# EAGLE design cc-driver-pico-host-board-as-built (EAGLE 7.7.0)
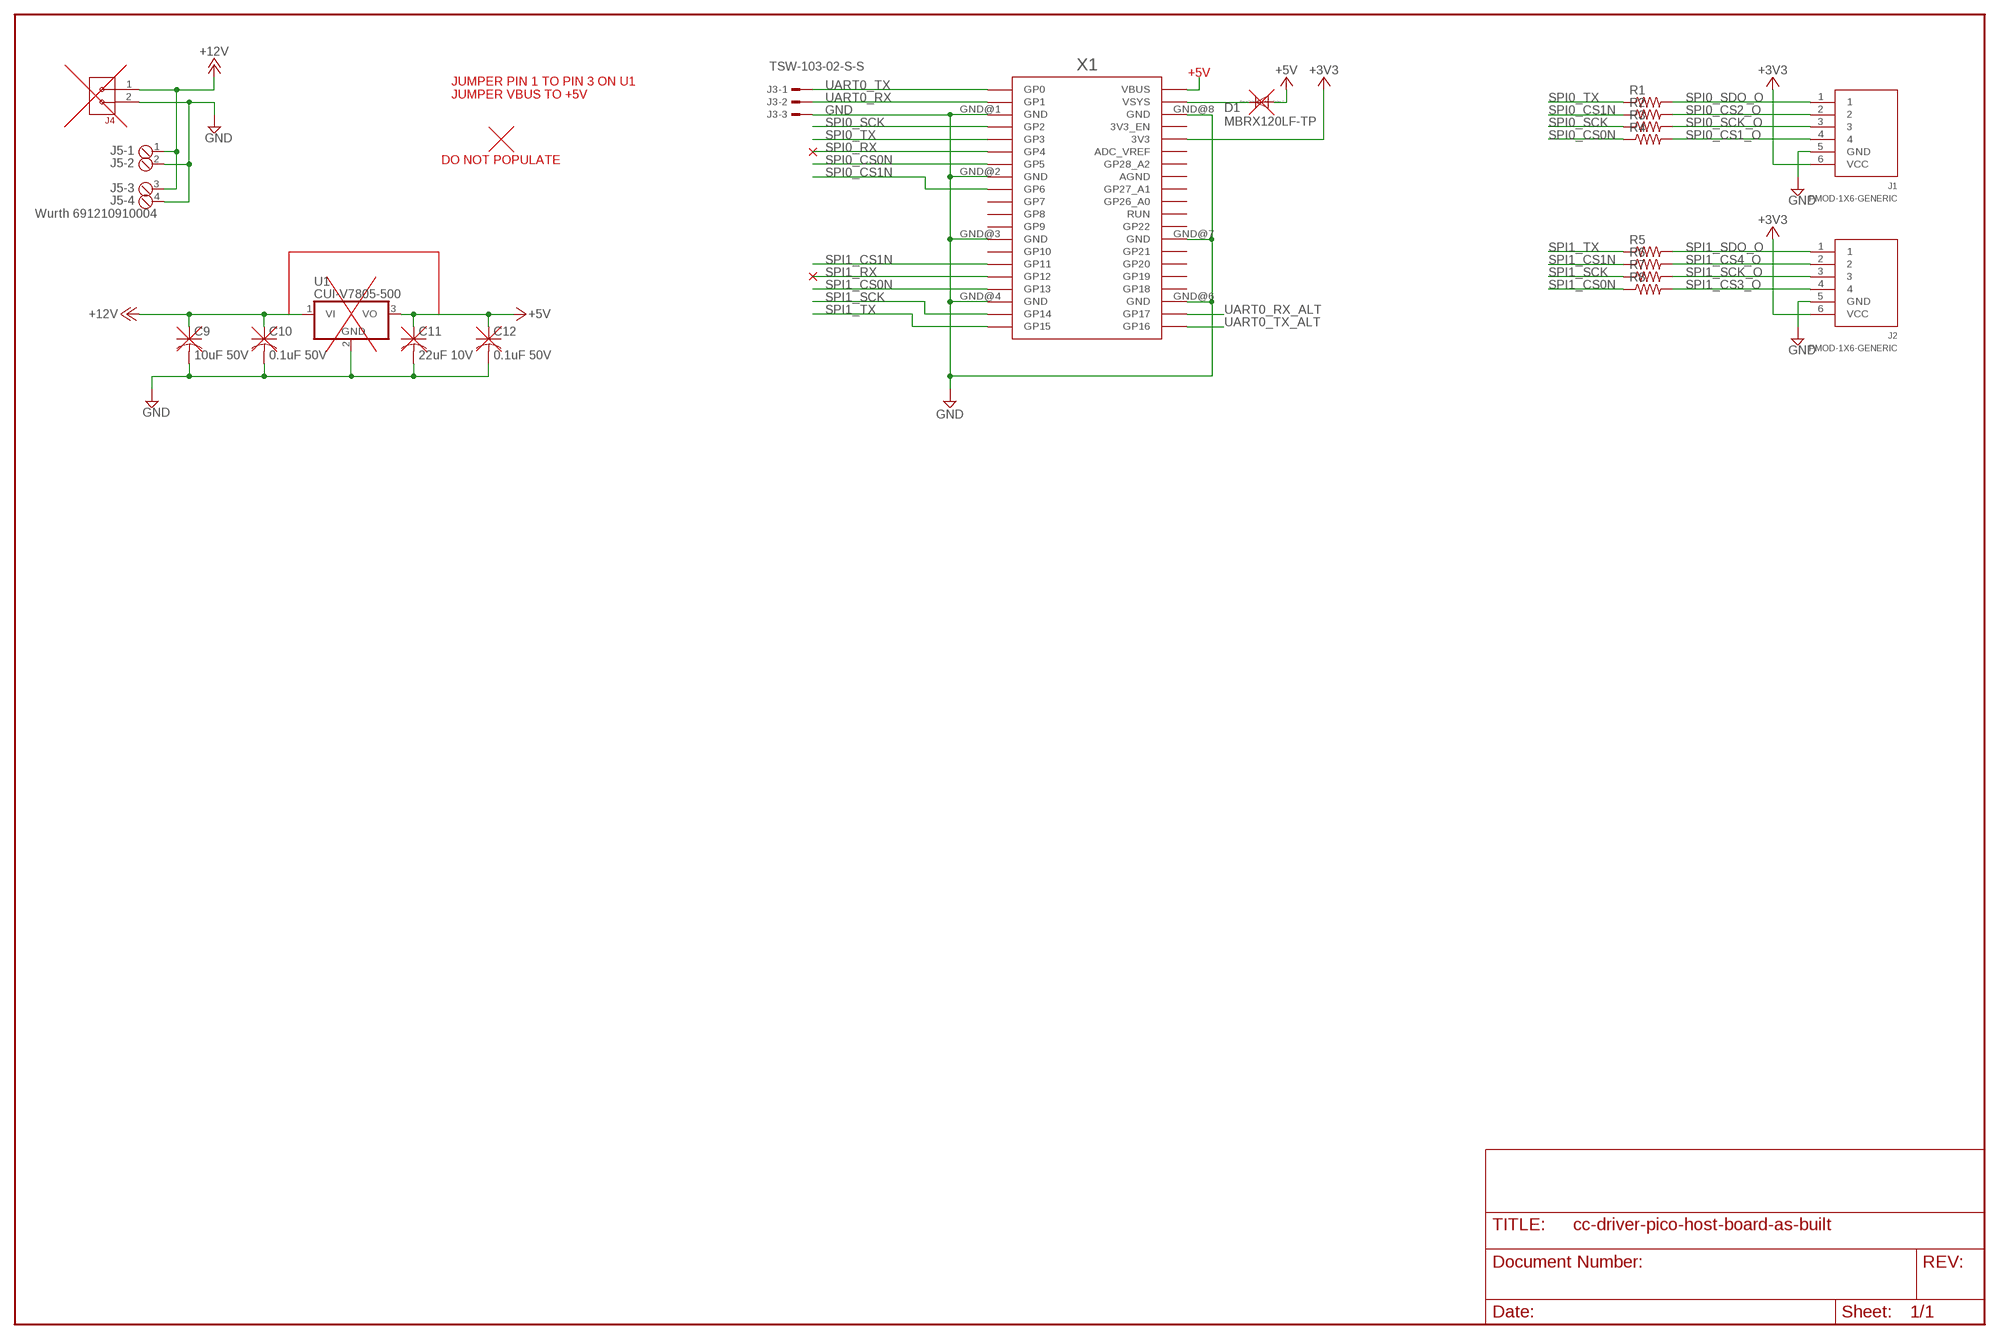
[diagram p0: schematic, sheet 1]

## Parts
C9  10uF 50V  C-USC1210K  [C1210K]
C10  0.1uF 50V  C-USC1206K  [C1206K]
C11  22uF 10V  C-USC1206K  [C1206K]
C12  0.1uF 50V  C-USC1206K  [C1206K]
D1  MBRX120LF-TP  MBR0520LT  [SOD123]
J1  PMOD-1X6-GENERIC  [CON-PMOD-1X6]
J2  PMOD-1X6-GENERIC  [CON-PMOD-1X6]
J3  TSW-103-02-S-S  [TSW-103-02-S-S]
J4  CON-3.81MM-1X2-PHOENIX  [CON-PHOENIX-3.81-1X2-RA]
J5  Wurth 691210910004  MPT4  [4POL254]
R1  R-US_R0603  [R0603]
R2  R-US_R0603  [R0603]
R3  R-US_R0603  [R0603]
R4  R-US_R0603  [R0603]
R5  R-US_R0603  [R0603]
R6  R-US_R0603  [R0603]
R7  R-US_R0603  [R0603]
R8  R-US_R0603  [R0603]
U1  CUI-V7805-500  CUI-V7803-500  [CUI-78XX-500]
X1  RPI_PICO_IG-TH  [RPI_PICO_TH]

## Nets
+3V3: J1.6(VCC) J2.6(VCC) X1.3V3
+5V: C11.1 C12.1 D1.A U1.3(VO)
+12V: C9.1 C10.1 J4.1 J5.1 J5.3 U1.1(VI)
GND: C9.2 C10.2 C11.2 C12.2 J1.5(GND) J2.5(GND) J3.3 J4.2 J5.2 J5.4 U1.2(GND) X1.GND@1(GND) X1.GND@2(GND) X1.GND@3(GND) X1.GND@4(GND) X1.GND@6(GND) X1.GND@7(GND) X1.GND@8(GND)
N$1: X1.VBUS
SPI0_CS0N: R4.1 X1.GP5
SPI0_CS1_O: J1.4 R4.2
SPI0_CS1N: R2.1 X1.GP6
SPI0_CS2_O: J1.2 R2.2
SPI0_RX: X1.GP4
SPI0_SCK: R3.1 X1.GP2
SPI0_SCK_O: J1.3 R3.2
SPI0_SDO_O: J1.1 R1.2
SPI0_TX: R1.1 X1.GP3
SPI1_CS0N: R8.1 X1.GP13
SPI1_CS1N: R6.1 X1.GP11
SPI1_CS3_O: J2.4 R8.2
SPI1_CS4_O: J2.2 R6.2
SPI1_RX: X1.GP12
SPI1_SCK: R7.1 X1.GP14
SPI1_SCK_O: J2.3 R7.2
SPI1_SDO_O: J2.1 R5.2
SPI1_TX: R5.1 X1.GP15
UART0_RX: J3.2 X1.GP1
UART0_RX_ALT: X1.GP17
UART0_TX: J3.1 X1.GP0
UART0_TX_ALT: X1.GP16
VSYS: D1.C X1.VSYS
Unconnected: X1.3V3_EN X1.ADC_VREF X1.AGND X1.GP7 X1.GP8 X1.GP9 X1.GP10 X1.GP18 X1.GP19 X1.GP20 X1.GP21 X1.GP22 X1.GP26_A0 X1.GP27_A1 X1.GP28_A2 X1.RUN

## Notes on the sheet
- JUMPER PIN 1 TO PIN 3 ON U1
  JUMPER VBUS TO +5V
- +5V
- DO NOT POPULATE

## Library data of the parts
C9 = rcl:C-US: CAPACITOR, American symbol; MFR: KEMET; MFR_PART_NO: C1210C106K5RACTU
C10 C12 = rcl:C-US: CAPACITOR, American symbol; MFR: KEMET; MFR_PART_NO: C1206S104M5RACTU
C11 = rcl:C-US: CAPACITOR, American symbol; MFR: KEMET; MFR_PART_NO: C1206C226K8RAC7800
D1 = diode:MBR0520LT: SCHOTTKY BARRIER RECTIFIER Source: http://onsemi.com .. MBR0520LT1-D.pdf
J1 J2 = 0GlenConnectors:PMOD-1X6-GENERIC
J3 = con-samtec:TSW-103-02-S-S: THROUGH-HOLE .025" SQ POST HEADER Source: Samtec TSW.pdf; OC_FARNELL: unknown; OC_NEWARK: unknown
J4 = 0GlenConnectors:CON-3.81MM-1X2-PHOENIX
J5 = con-phoenix-254:MPT4: PHOENIX CONNECTOR; OC_FARNELL: unknown; OC_NEWARK: unknown
R1-R8 = rcl:R-US_: RESISTOR, American symbol
U1 = GlenPartsLibrary:CUI-V7803-500
X1 = RaspberryPi_Pico:RPI_PICO_IG

## Board
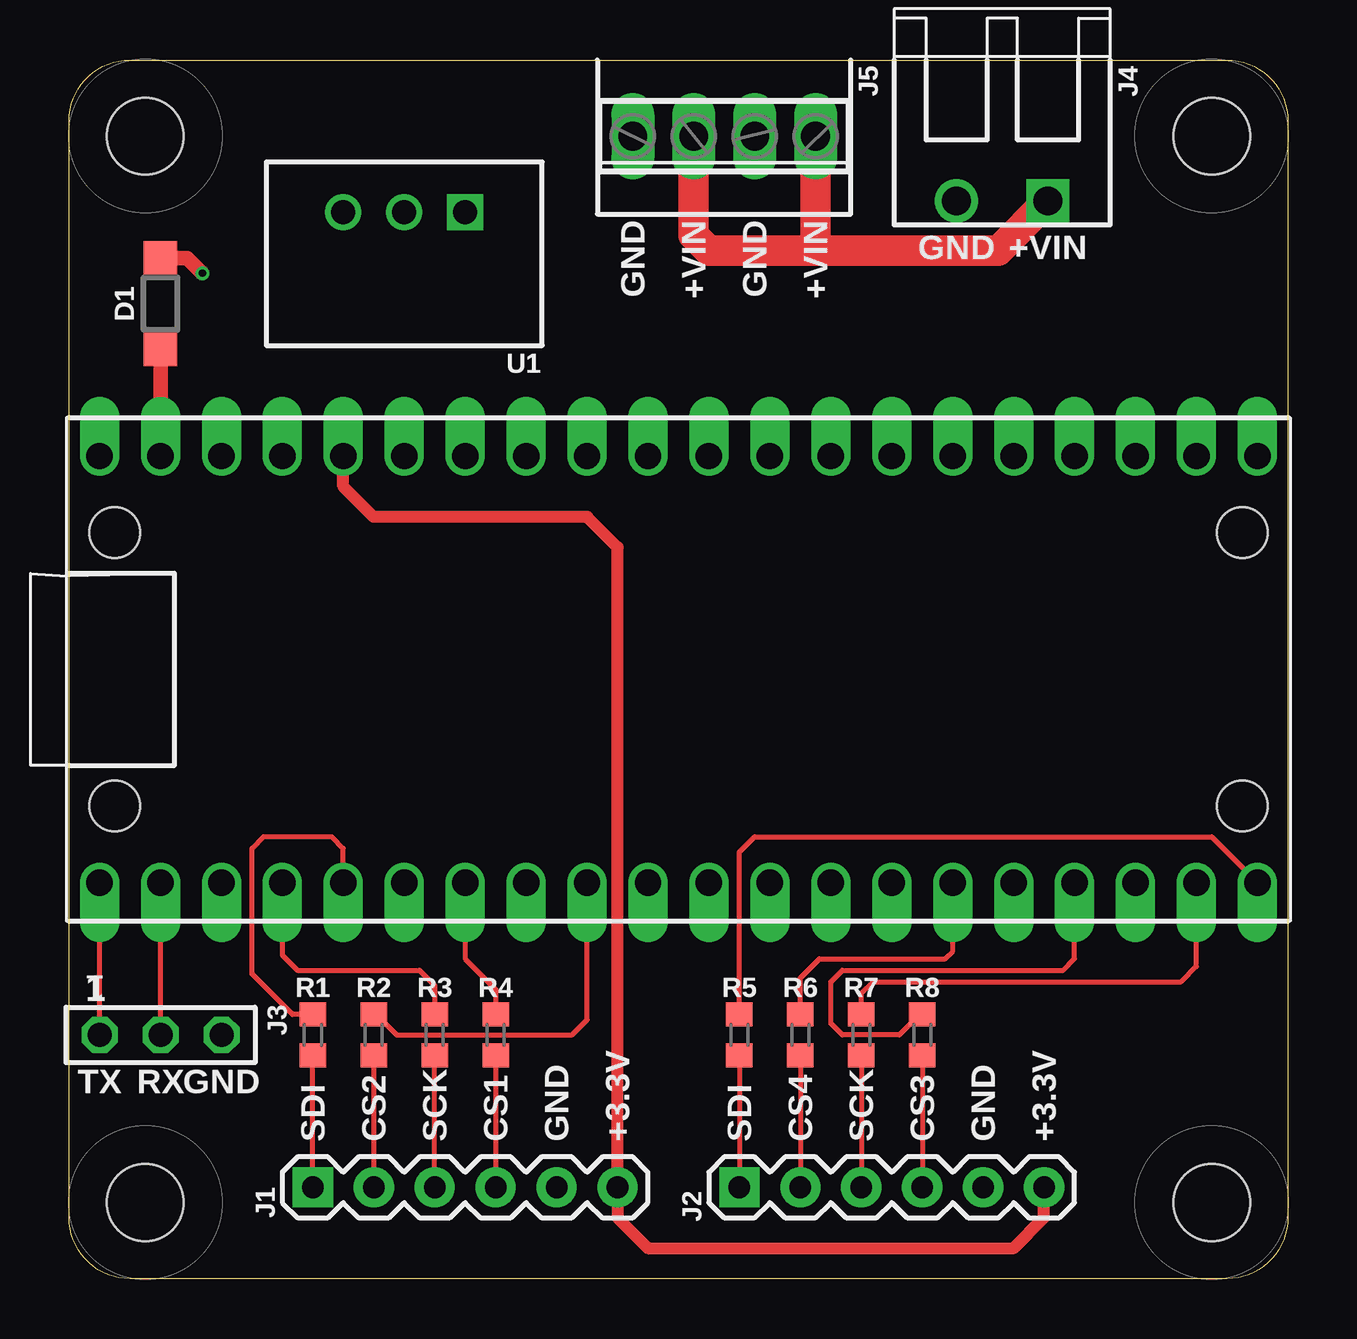
[diagram p1: board, top side]
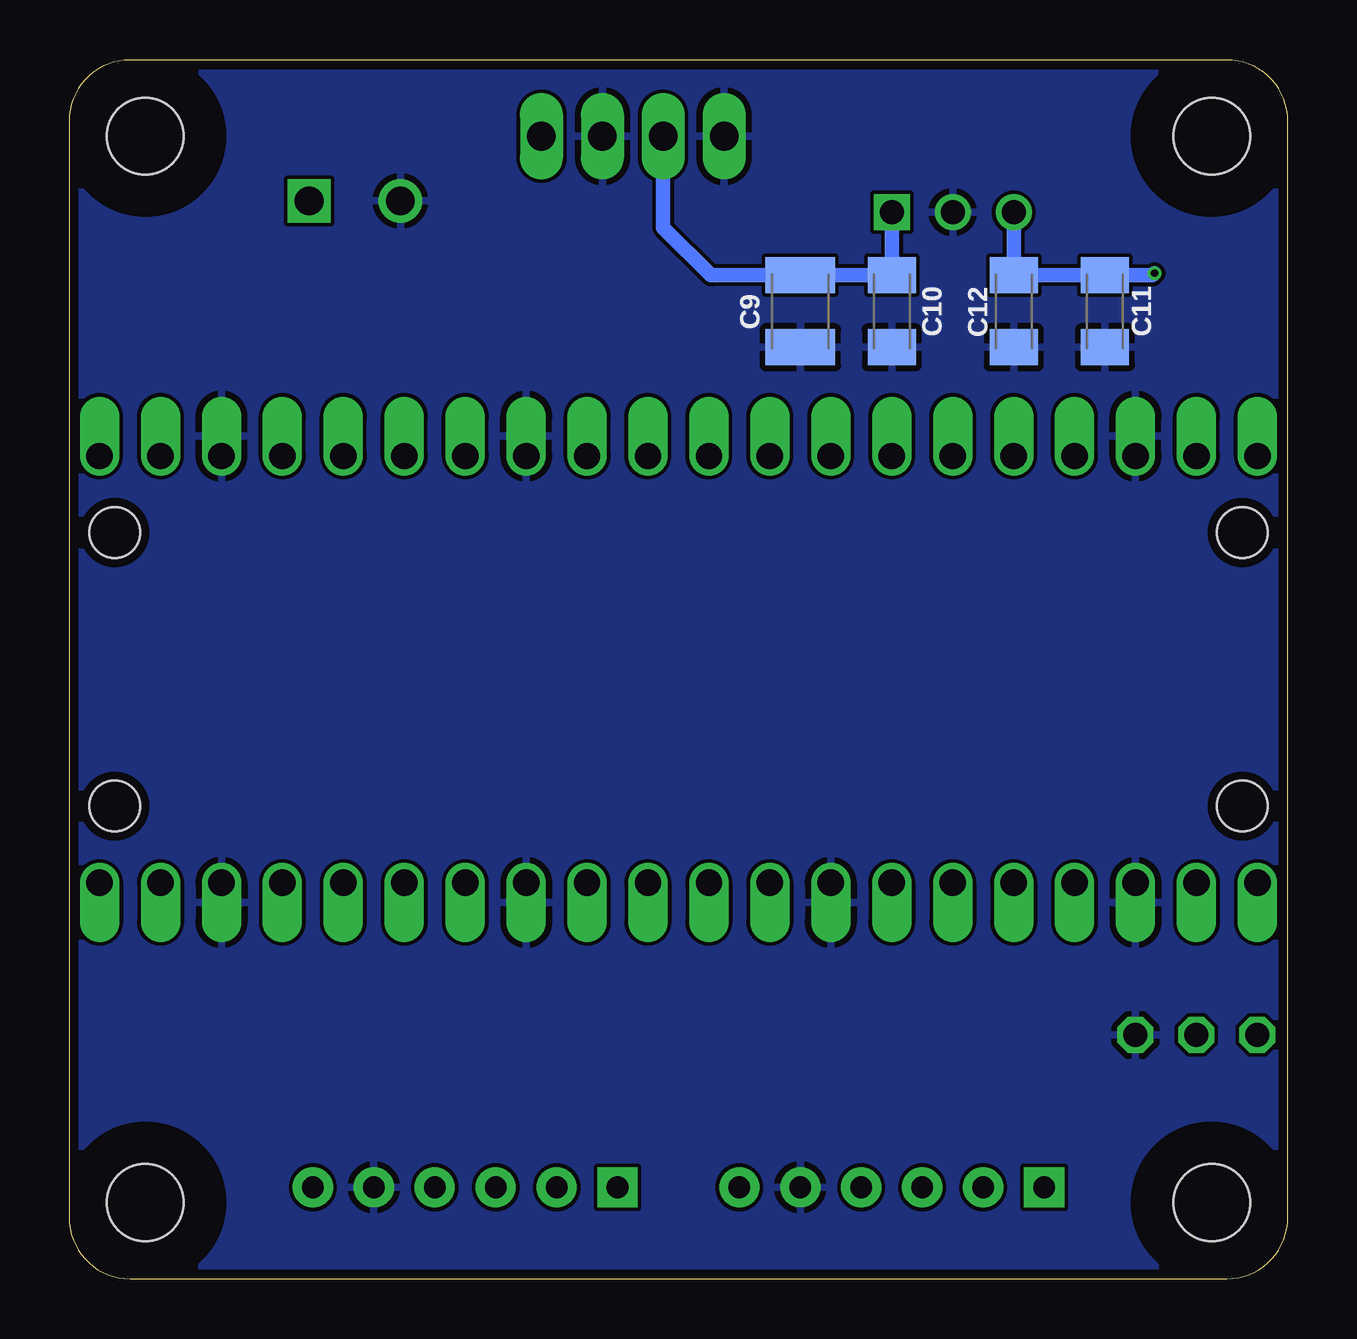
[diagram p2: board, bottom side, seen from below]

Size 50.8 x 50.8 mm. Coordinates in mm from the lower left corner, seen from the top.
Outline: 0,48.26 arc-90 2.54,50.8 48.26,50.8 arc-90 50.8,48.26 50.8,2.54 arc-90 48.26,0 2.54,0 arc-90 0,2.54 0,48.26
Copper layers (1*16): Top 0.035559375mm / dielectric 1.6mm / Bottom 0.035559375mm
Design rules "oshpark-2layer-2018": minimum track width 6mil, minimum drill 10mil, track to track 6mil, track to pad 6mil, pad to pad 6mil, via to via 6mil, smd to smd 6mil, copper to edge 15mil, drill to drill 6mil, minimum pad ring 5mil, minimum via ring 5mil, stop-mask expansion 2.5mil, vias tented up to drill 0mil, thermal gap 10mil
Holes 3.2 mm at 3.17,47.62 47.62,47.62 47.62,3.17 3.17,3.17
tRestrict: area 0,44.4 to 6.4,50.8; area 44.4,44.4 to 50.8,50.8; area 44.4,0 to 50.8,6.4; area 0,0 to 6.4,6.4
bRestrict: area 0,44.4 to 6.4,50.8; area 44.4,44.4 to 50.8,50.8; area 44.4,0 to 50.8,6.4; area 0,0 to 6.4,6.4

### Footprints (pad centres in the part's own frame; a part is rotated, then mirrored left to right if it is on the bottom)
C1210K = smd 1.5 x 2.9: 1 -1.5,0; 2 1.5,0
C1206K = smd 1.5 x 2: 1 -1.5,0; 2 1.5,0
SOD123 = smd 1.4 x 1.4: A 1.9,0; C -1.9,0
CON-PMOD-1X6 = drill 0.9 pad 1.676 square: 1 0,6.35 | drill 0.9 pad 1.676: 2 0,3.81; 3 0,1.27; 4 0,-1.27; 5 0,-3.81; 6 0,-6.35
TSW-103-02-S-S = drill 1 pad 1.5 octagon: 1 2.54,0; 2 0,0; 3 -2.54,0
CON-PHOENIX-3.81-1X2-RA = drill 1.2 square: 1 0,0 | drill 1.2: 2 3.81,0
4POL254 = drill 1.2 long: 1 -3.81,0; 2 -1.27,0; 3 1.27,0; 4 3.81,0
R0603 = smd 1 x 1.1: 1 -0.85,0; 2 0.85,0
CUI-78XX-500 = drill 1 square: 1 0,0 | drill 1: 2 2.54,0; 3 5.08,0
RPI_PICO_TH = drill 1.1 pad 1.6 offset: 3V3 8.89,13.97; 3V3_EN 8.89,16.51; ADC_VREF 8.89,11.43; AGND 8.89,6.35; GND@1 -8.89,19.05; GND@2 -8.89,6.35; GND@3 -8.89,-6.35; GND@4 -8.89,-19.05; GND@6 8.89,-19.05; GND@7 8.89,-6.35; GND@8 8.89,19.05; GP0 -8.89,24.13; GP1 -8.89,21.59; GP2 -8.89,16.51; GP3 -8.89,13.97; GP4 -8.89,11.43; GP5 -8.89,8.89; GP6 -8.89,3.81; GP7 -8.89,1.27; GP8 -8.89,-1.27; GP9 -8.89,-3.81; GP10 -8.89,-8.89; GP11 -8.89,-11.43; GP12 -8.89,-13.97; GP13 -8.89,-16.51; GP14 -8.89,-21.59; GP15 -8.89,-24.13; GP16 8.89,-24.13; GP17 8.89,-21.59; GP18 8.89,-16.51; GP19 8.89,-13.97; GP20 8.89,-11.43; GP21 8.89,-8.89; GP22 8.89,-3.81; GP26_A0 8.89,1.27; GP27_A1 8.89,3.81; GP28_A2 8.89,8.89; RUN 8.89,-1.27; VBUS 8.89,24.13; VSYS 8.89,21.59 | hole 2.1: -5.7,23.5; 5.7,23.5; -5.7,-23.5; 5.7,-23.5

### Placement (x,y rotation side)
C9  20.32,40.32 270 bottom
C10  16.51,40.32 270 bottom
C11  7.62,40.32 270 bottom
C12  11.43,40.32 270 bottom
D1  3.81,40.64 90 top
J1  16.51,3.81 90 top
J2  34.29,3.81 90 top
J3  3.81,10.16 180 top
J4  40.8,44.93 180 top
J5  27.3,47.62 180 top
R1  10.16,10.16 270 top
R2  12.7,10.16 270 top
R3  15.24,10.16 270 top
R4  17.78,10.16 270 top
R5  27.94,10.16 270 top
R6  30.48,10.16 270 top
R7  33.02,10.16 270 top
R8  35.56,10.16 270 top
U1  16.51,44.45 180 top
X1  25.4,25.4 90 top

### Tracks (layer width: path | path; a pad name or v marks a point on that pad's centre or on a via)
+3V3
  Top 0.508: J2.6 40.64,2.54 39.37,1.27 24.13,1.27 22.86,2.54 J1.6 22.86,30.48 21.59,31.75 12.7,31.75 11.43,33.02 X1.3V3
+5V  (via drill 0.3)
  Top 0.61: D1.A 4.93,42.54 v5.56,41.91
  Bottom 0.61: U1.3 C12.1 C11.1 5.64,41.82 v5.56,41.91
+12V
  Top 1.27: J5.3 26.04,43.5 26.67,42.86 31.11,42.86 | J5.1 31.11,42.86 | 31.11,42.86 38.73,42.86 J4.1
  Bottom 0.61: U1.1 C10.1 C9.1 24.04,41.82 26.04,43.81 J5.3
GND
  pour Bottom (isolate 0.152): 0,50.8 50.8,50.8 50.8,0 0,0
SPI0_CS0N
  Top 0.203: X1.GP5 16.51,13.34 17.78,12.06 R4.1
SPI0_CS1_O
  Top 0.203: R4.2 J1.4
SPI0_CS1N
  Top 0.203: R2.1 12.8,11.01 13.65,10.16 20.95,10.16 21.59,10.79 X1.GP6
SPI0_CS2_O
  Top 0.203: R2.2 J1.2
SPI0_SCK
  Top 0.203: X1.GP2 8.89,13.49 9.53,12.86 14.61,12.86 15.24,12.22 R3.1
SPI0_SCK_O
  Top 0.203: J1.3 R3.2
SPI0_SDO_O
  Top 0.203: J1.1 R1.2
SPI0_TX
  Top 0.203: R1.1 9.31,11.01 7.62,12.7 7.62,17.94 8.1,18.41 10.95,18.41 11.43,17.94 X1.GP3
SPI1_CS0N
  Top 0.203: R8.1 35.46,11.01 34.61,10.16 32.23,10.16 31.75,10.64 31.75,12.38 32.23,12.86 41.43,12.86 41.91,13.34 X1.GP13
SPI1_CS1N
  Top 0.203: R6.1 30.48,12.54 31.27,13.34 36.51,13.34 36.83,13.65 X1.GP11
SPI1_CS3_O
  Top 0.203: R8.2 J2.4
SPI1_CS4_O
  Top 0.203: R6.2 J2.2
SPI1_SCK
  Top 0.203: R7.1 33.02,11.91 33.5,12.38 46.35,12.38 46.99,13.02 X1.GP14
SPI1_SCK_O
  Top 0.203: R7.2 J2.3
SPI1_SDO_O
  Top 0.203: R5.2 J2.1
SPI1_TX
  Top 0.203: R5.1 27.94,17.78 28.57,18.41 47.62,18.41 X1.GP15
UART0_RX
  Top 0.203: J3.2 X1.GP1
UART0_TX
  Top 0.203: J3.1 X1.GP0
VSYS
  Top 0.61: X1.VSYS D1.C

### Text on the board
_tsilk: J5 | J4 | GND | +VIN | GND | +VIN | GND | +VIN | D1 | U1 | 1 | R1 | R2 | R3 | R4 | R5 | R6 | R7 | R8 | J3 | TX | RX | GND | SDI | CS2 | SCK | CS1 | GND | +3.3V | SDI | CS4 | SCK | CS3 | GND | +3.3V | J1 | J2
_bsilk: C11 | C12 | C10 | C9